# EAGLE design Adafruit 128x64 Mono OLED PCB v2 (EAGLE 6.2)
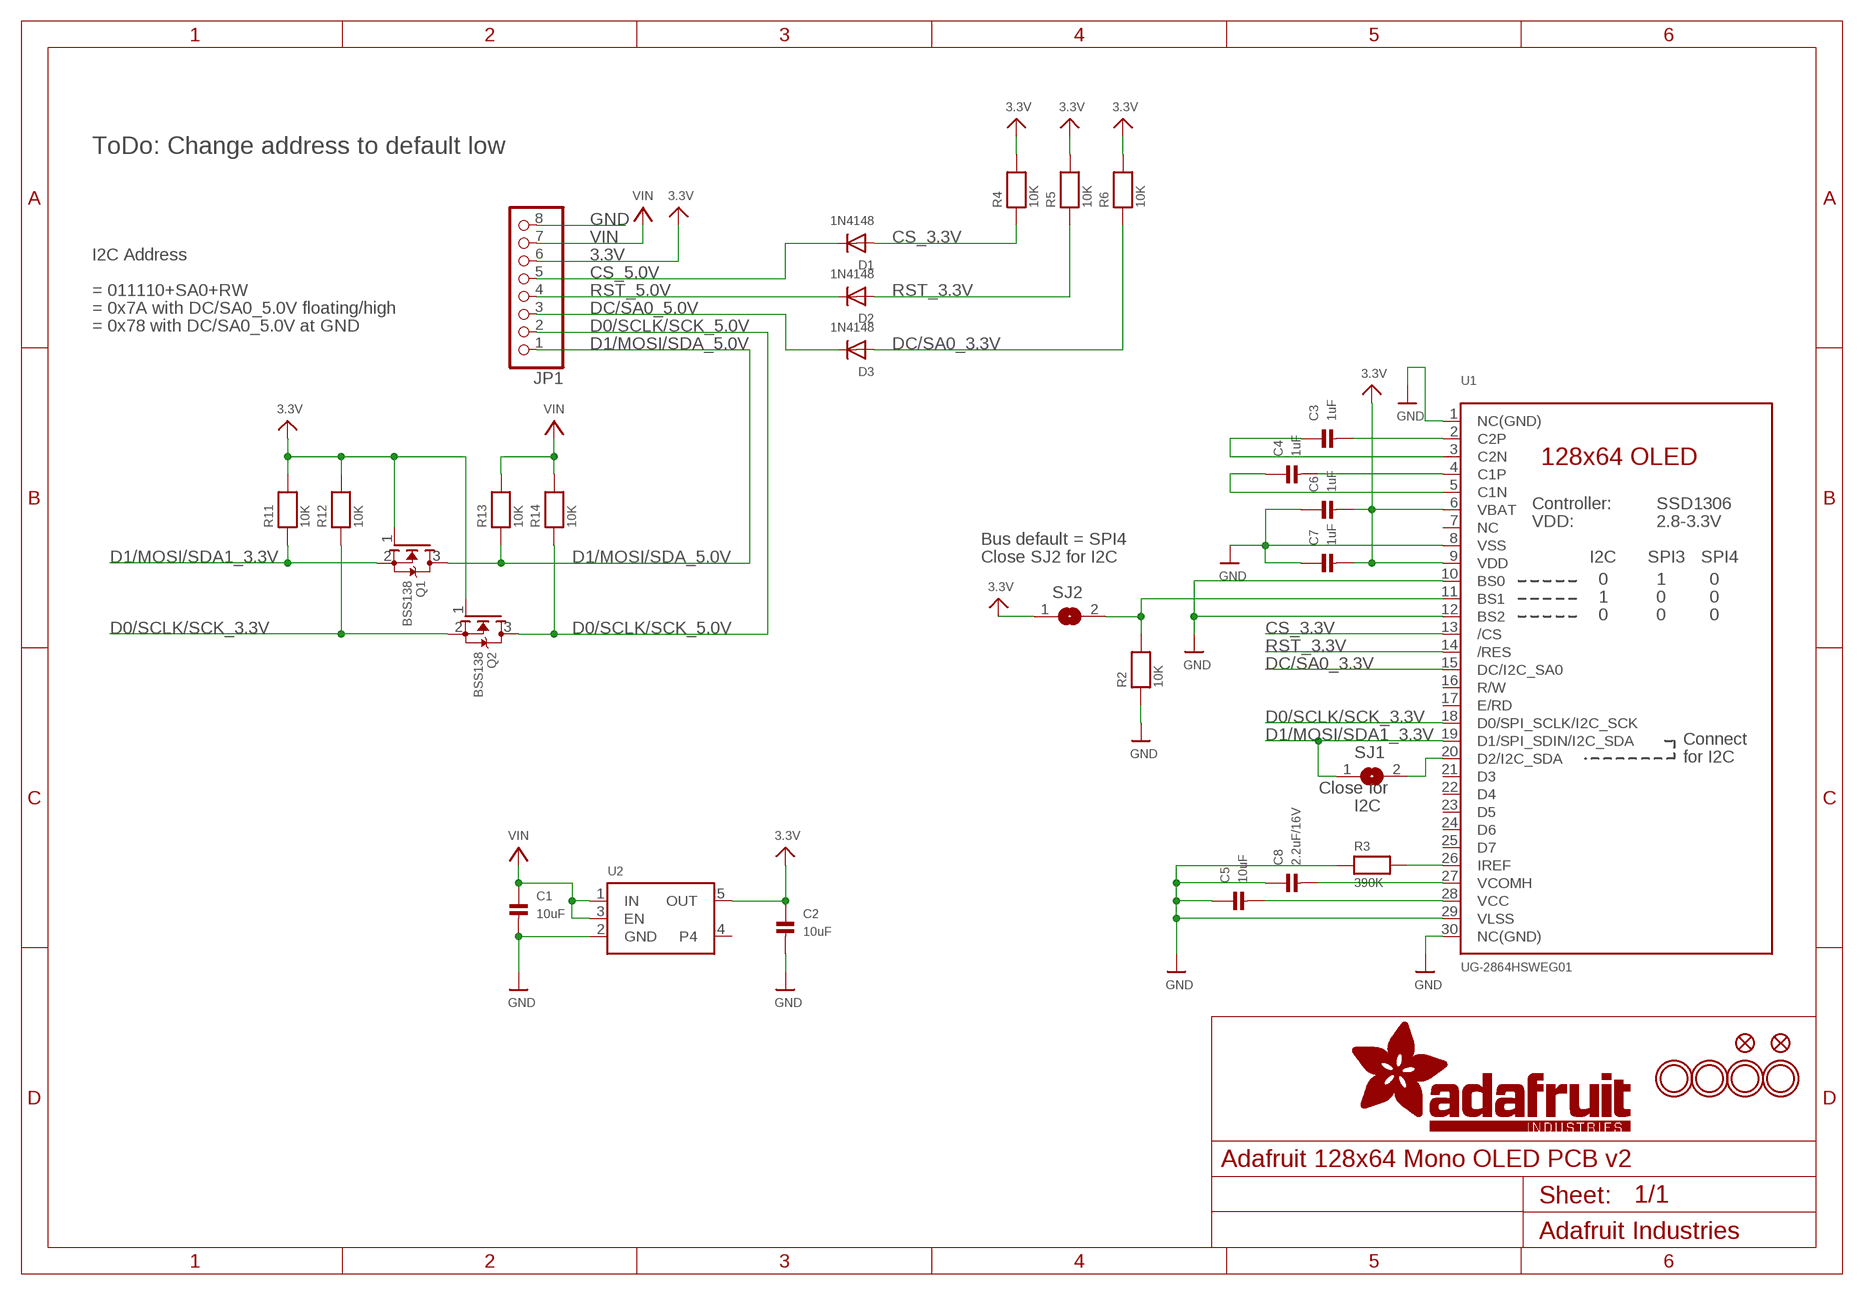
[diagram p0: schematic, sheet 1]

## Parts
C1  10uF  CAP_CERAMIC0805  [0805]
C2  10uF  CAP_CERAMIC0805  [0805]
C3  1uF  CAP_CERAMIC0805  [0805]
C4  1uF  CAP_CERAMIC0805  [0805]
C5  10uF  CAP_CERAMIC0805  [0805]
C6  1uF  CAP_CERAMIC0805  [0805]
C7  1uF  CAP_CERAMIC0805  [0805]
C8  2.2uF/16V  CAP_CERAMIC0805  [0805]
D1  1N4148  DIODESOD-323  [SOD-323]
D2  1N4148  DIODESOD-323  [SOD-323]
D3  1N4148  DIODESOD-323  [SOD-323]
FID1  FIDUCIAL""  [FIDUCIAL_1MM]
FID2  FIDUCIAL""  [FIDUCIAL_1MM]
JP1  HEADER-1X870MIL  [1X08_ROUND_70]
Q1  BSS138  MOSFET-NWIDE  [SOT23-WIDE]
Q2  BSS138  MOSFET-NWIDE  [SOT23-WIDE]
R2  10K  RESISTOR0805  [0805]
R3  390K  RESISTOR0805  [0805]
R4  10K  RESISTOR0805  [0805]
R5  10K  RESISTOR0805  [0805]
R6  10K  RESISTOR0805  [0805]
R11  10K  RESISTOR0805  [0805]
R12  10K  RESISTOR0805  [0805]
R13  10K  RESISTOR0805  [0805]
R14  10K  RESISTOR0805  [0805]
SJ1  SOLDERJUMPERREFLOW_NOPASTE  [SOLDERJUMPER_REFLOW_NOPASTE]
SJ2  SOLDERJUMPERREFLOW_NOPASTE  [SOLDERJUMPER_REFLOW_NOPASTE]
U1  UG-2864HSWEG01  DISP_OLED_UG-2864HSWEG010.96"  [UG-2864HSWEG01_0.96IN_WRAPAROUND]
U2  VREG_SOT23-5  [SOT23-5]
U$23  MOUNTINGHOLE2.5  [MOUNTINGHOLE_2.5_PLATED]
U$24  MOUNTINGHOLE2.5  [MOUNTINGHOLE_2.5_PLATED]
U$25  MOUNTINGHOLE2.5  [MOUNTINGHOLE_2.5_PLATED]
U$26  MOUNTINGHOLE2.5  [MOUNTINGHOLE_2.5_PLATED]

## Nets
3.3V: C2.1 C6.2 C7.2 JP1.6 Q1.1(G) Q2.1(G) R4.2 R5.2 R6.2 R11.2 R12.2 SJ2.1 U1.6(VBAT) U1.9(VDD) U2.5(OUT)
CS_3.3V: D1.A R4.1 U1.13(/CS)
CS_5.0V: D1.C JP1.5
D0/SCLK/SCK_3.3V: Q2.2(S) R12.1 U1.18(D0/SPI_SCLK/I2C_SCK)
D0/SCLK/SCK_5.0V: JP1.2 Q2.3(D) R14.1
D1/MOSI/SDA1_3.3V: Q1.2(S) R11.1 SJ1.1 U1.19(D1/SPI_SDIN/I2C_SDA)
D1/MOSI/SDA_5.0V: JP1.1 Q1.3(D) R13.1
DC/SA0_3.3V: D3.A R6.1 U1.15(DC/I2C_SA0)
DC/SA0_5.0V: D3.C JP1.3
GND: C1.2 C2.2 C5.1 C6.1 C7.1 C8.1 JP1.8 R2.1 R3.1 U1.1(NC(GND)) U1.8(VSS) U1.10(BS0) U1.12(BS2) U1.29(VLSS) U1.30(NC(GND)) U2.2(GND)
N$1: R2.2 SJ2.2 U1.11(BS1)
N$2: SJ1.2 U1.20(D2/I2C_SDA)
N$3: R3.2 U1.26(IREF)
N$4: C3.2 U1.2(C2P)
N$5: C3.1 U1.3(C2N)
N$6: C4.2 U1.4(C1P)
N$7: C4.1 U1.5(C1N)
N$11: C5.2 U1.28(VCC)
N$12: C8.2 U1.27(VCOMH)
RST_3.3V: D2.A R5.1 U1.14(/RES)
RST_5.0V: D2.C JP1.4
VIN: C1.1 JP1.7 R13.2 R14.2 U2.1(IN) U2.3(EN)
Unconnected: U1.7(NC) U1.16(R/W) U1.17(E/RD) U1.21(D3) U1.22(D4) U1.23(D5) U1.24(D6) U1.25(D7) U2.4

## Notes on the sheet
- ToDo: Change address to default low
- I2C Address
- = 011110+SA0+RW
- = 0x7A with DC/SA0_5.0V floating/high
- = 0x78 with DC/SA0_5.0V at GND
- Bus default = SPI4
- Close SJ2 for I2C
- Close for
- I2C

## Library data of the parts
C1-C8 = microbuilder:CAP_CERAMIC: Ceramic Capacitors 0402 - 0402 Surface Mount Capacitors 16pF 50V 5% [Digikey: 445-4899-2-ND] 18pF 50V 5% [Digikey: 490-1281-2-ND] 22pF 50V 5% [Digikey: 490-1283-2-ND] 68pF 50V 5% [Digikey: 490-1289-2-ND] 0.1uF 10V 10% [Digikey: 490-1318-2-ND] 1.0uF 6.3V 10% [Digikey: 490-1320-2-ND] 0603 - 0603 Surface Mount Capacitors 16 pF 50V 5% [Digikey: 445-5051-2-ND] 22 pF 50V [Digikey: PCC220ACVTR-ND] 33 pF 50V 5% [Digikey: 490-1415-1-ND] 56pF 50V 5% [Digikey: 490-1421-1-ND] 220pF 50V 5% [Digikey: 445-1285-1-ND] 680 pF 50V 2200 pF 50V 5% C0G [Digikey: 445-1297-1-ND] 5600 pF 100V 5% X7R [Digikey: 478-3711-1-ND] 0.1 µF 25V 10% [Digikey: PCC2277TR-ND] 0.22 µF 16V 10% X7R [Digikey: 445-1318-1-ND] 1.0 µF 25V 10% [Digikey: 445-5146-2-ND] 0603 - RF Specific 3pF 250V +/-0.1pF RF [Digikey: 712-1347-1-ND] 18 pF 250V 5% [Digikey: 478-3505-1-ND or 712-1322-1-ND] 56 pF 250V 5% C0G RF [Digikey: 490-4867-1-ND] 68 pF 250V RF [Digikey: 490-4868-1-ND] 0805 - 0805 Surface Mount Capacitors 220 pF 250V 2% RF Ceramic Capacitor [Digikey: 712-1398-1-ND] 1000 pF 50V 2% NP0 Ceramic Capacitor [Digikey: 478-3760-1-ND] 0.1 µF 25V 10% Ceramic Capacitor [Digikey: PCC1828TR-ND] 1.0 µF 16V 10% Ceramic Capacitor[Digikey: 490-1691-2-ND] 10.0 µF 10V 10% Ceramic Capacitor[Digikey: 709-1228-1-ND] 10.0 uF 16V 10% Ceramic Capacitor [Digikey: 478-5165-2-ND] 47 uF 6.3V 20% Ceramic Capacitor [Digikey: 587-1779-1-ND or 399-5506-1-ND] 1206 - 1206 Surface Mount Capacitors 47uF 10V 20% Ceramic Capacitor [Digikey: 490-5528-1-ND or 399-5508-1-ND or 445-6010-1-ND] 100uF 6.3V -20%, +80% Y5V Ceramic Capacitor (Digikey: 490-4512-1-ND, Mouser: 81-GRM31CF50J107ZE1L)
D1-D3 = microbuilder:DIODE: Diode SMA Model Volts Amps Type Vf Vr Digikey # Notes SSA34-E3 40V 3A Schottky 480mV @ 3A 200uA @ 40V SSA34-E3/61TGITR-ND CDBA120-G 20V 1A Schottky 500mV @ 1A 500uA @ 20V 641-1014-6-ND REEL MBRA210 10V 2A Schottky 350mV @ 2A 700uA @ 10V MBRA210LT3 SOD-123 Model Volts Amps Type Vf Vr Order # Notes BAT54T1G 30V 200mA Schottky 800mV @ 200mA 2uA @ 25V BAT54T1GOSTR-ND B0530W 30V 500mA Schottky 430mV @ 500mA 130uA @ 30V B0530W-FDICT-ND REEL MBR120 1A 20V Schottky 340mV @ 1A MBR120VLSFT1GOSCT-ND SOD-323 Model Volts Amps Type Vf Vr Order # Notes ZLLS410 10V 570mA Schottky 380mV @ 570mA ZLLS410CT-ND 1N4148WS 75V 150mA Silicon/Simple 1V 1N4148WSFSCT-ND REEL SOD-523 Model Volts Amps Type Vf Vr Order # Notes BAT54XV2 30V 200mA Schottky 0.8V @ 100mA BAT54XV2CT-ND TB751S 30V 30mA Schottky RB751S-40TE61CT-ND SOT23-R/W (R = Solder Paste/Reflow Ovens, W = Hand-Soldering) Model Volts Amps Type Vf Vr Order # Notes BAT54FILM 40V 300mA Schottky 497-7162-1-ND
FID1 FID2 = microbuilder:FIDUCIAL: Fiducial Alignment Points Various fiducial points for machine vision alignment.
JP1 = microbuilder:HEADER-1X8: PIN HEADER
Q1 Q2 = microbuilder:MOSFET-N: N-Channel Mosfet LEGEND VDS: Voltage Drain-Source ID: Drain Current RDS(ON): Drain-Source On-State Resistance VGS(TH): Gate-Source Threshold Voltage CISS: Drain-Source Input Capacitance SOT-23 Name VDS ID RDS(ON) VGS(TH) CISS Order Number 2N7002E 60V 260mA 2.5 Ohm 2.5V @ 250uA 26.7pF @ 25V 2N7002ET1GOSTR-ND BSH103 30V 850mA 400 mOhm 400mV @ 1mA 83pF @ 24V BSH103,235-ND BSS138 60V 320mA 1.6 Ohm 1.5V @ 250uA 50pF @ 10V Mouser: 771-BSS138PW115 * BSS138 good choice for I2C level-shifting
R2-R6 R11-R14 = microbuilder:RESISTOR: Resistors 0402 - 0402 Surface Mount Package 22 Ohm 1% 1/16W [Digikey: 311-22.0LRTR-ND] 33 Ohm 5% 1/16W 1.0K 5% 1/16W 1.5K 5% 1/16W 2.0K 1% 1/16W 10.0K 1% 1/16W [Digikey: 311-10.0KLRTR-ND] 10.0K 5% 1/16W [Digikey: RMCF0402JT10K0TR-ND] 12.1K 1% 1/16W [Digikey: 311-22.0LRTR-ND] 100.0K 5% 1/16W 0603 - 0603 Surface Mount Package 0 Ohm 1/10 Watt 1% Resistor 15 Ohm 1/10 Watt 1% Resistor 33 Ohm 1/10 Watt 1% Resistor 49.9 Ohm 1/10 Watt 1% Resistor 100 Ohm 1/10 Watt 1% Resistor 150 Ohm 1/10 Watt 1% Resistor 240 Ohm 1/10 Watt 1% Resistor 390 Ohm 1/10 Watt 1% Resistor 560 Ohm 1/10 Watt 1% Resistor 680 Ohm 1/10 Watt 1% Resistor 750 Ohm 1/10 Watt 1% Resistor 1.0K Ohm 1/10 Watt 1% Resistor 1.5K Ohm 1/10 Watt 1% Resistor 2.0K Ohm 1/10 Watt 1% Resistor 2.2K Ohm 1/10 Watt 1% Resistor 3.3K Ohm 1/10 Watt 1% Resistor 4.7K Ohm 1/10 Watt 1% Resistor 10.0K Ohm 1/10 Watt 1% Resistor 12.0K Ohm 1/10 Watt 1% Resistor 12.1K Ohm 1/10 Watt 1% Resistor 20.0K Ohm 1/10 Watt 1% Resistor 33.0K Ohm 1/10 Watt 1% Resistor 100.0K Ohm 1/10 Watt 1% Resistor 0805 - 0805 Surface Mount Package 0 Ohm 1/8 Watt 1% Resistor 33 Ohm 1/8 Watt 1% Resistor 100 Ohm 1/8 Watt 1% Resistor 150 Ohm 1/8 Watt 1% Resistor 200 Ohm 1/8 Watt 1% Resistor 240 Ohm 1/8 Watt 1% Resistor 330 Ohm 1/8 Watt 1% Resistor 390 Ohm 1/8 Watt 1% Resistor 470 Ohm 1/8 Watt 1% Resistor 1.0K Ohm 1/8 Watt 1% Resistor 1.5K Ohm 1/8 Watt 1% Resistor 2.0K Ohm 1/8 Watt 1% Resistor 4.7K Ohm 1/8 Watt 1% Resistor 5.1K Ohm 1/8 Watt 1% Resistor 5.6K Ohm 1/8 Watt 1% Resistor 10.0K Ohm 1/8 Watt 1% Resistor 22.0K Ohm 1/8 Watt 1% Resistor 33.0K Ohm 1/8 Watt 1% Resistor 100K Ohm 1/8 Watt 1% Resistor 1206 - 1206 Surface Mount Package 2012 - 2010 Surface Mount Package 0.11 Ohm 1/2 Watt 1% Resistor - Digikey: RHM.11UCT-ND
SJ1 SJ2 = microbuilder:SOLDERJUMPER: SMD Solder JUMPER Solder the two pads together to create a connection, or remove the solder to break it. REFLOW - Use this footprint for solder paste and reflow ovens. WAVE - Use this footprint for hand-soldering (larger pads). CLOSED - Has a trace between the two pads to ensure it is closed by default. The trace needs to be cut to disable the jumper, and can be closed again by creating a solder bridge between the two pads.
U1 = microbuilder:DISP_OLED_UG-2864HSWEG01: UG-2864HSWEG01 OLED display Both 1.3" and 0.96" models share the same FPC tab footprint, only the screen dimensions vary.
U2 = microbuilder:VREG_SOT23-5: SOT23-5 Fixed Voltage Regulators To better organise some of the SOT23-5 fixed voltage regulators in this library, this new part was created. Part Current Out V Out V In V Dropout Digikey Part No. ADP121 150mA 3.3V 3.4-5.5V 0.09V @ 150mA ADP121-AUJZ33R7CT-ND ADP121 150mA 3.0V 3.1-5.5V 0.09V @ 150mA ADP121-AUJZ30R7CT-ND ADP122 300mA 3.3V 3.4-5.5V 0.085V @ 300mA ADP122AUJZ-3.3-R7CT-ND ADP1712 300mA 3.3V 3.5-5.5V 0.17V @ 300mA ADP1712AUJZ-3.3-R7TR-ND AP7311 (Low Cost) 150mA 3.3V 3.5-6V 0.15V @ 150mA AP7311-33WG-7DICT-ND LD39015M18R 150mA 1.8V 1.9V-5.5V 0.08V @ 100mA 497-6977-1-ND MCP1824T-3302E/OT 300mA 3.3V 3.5V-6V 0.2V @ 300mA MCP1824T-3302E/OTCT-ND MIC5205-2.5YM5 TR 150mA 2.5V 2.7-16V 0.165V @ 150mA 576-1257-2-ND MIC5205-3.0YM5 TR 150mA 3.0V 3.2V-16V 0.165V @ 150mA 576-1258-2-ND MIC5205-3.3YM5 TR 150mA 3.3V 3.5V-16V 0.165V @ 150mA 576-1259-2-ND TPS780330220 150mA 3.3V+2.2V 3.6-5.5V 250mV Max 296-23332-1-ND TDA3663/N1,135 100mA 3.3V 3.5-45V 0.18V @ 50mA 568-5343-1-ND
U$23-U$26 = microbuilder:MOUNTINGHOLE: Mounting Hole For #2 screws (0.086"/2.18mm width, 0.094"/2.4mm hole) use 2.5mm

## Board
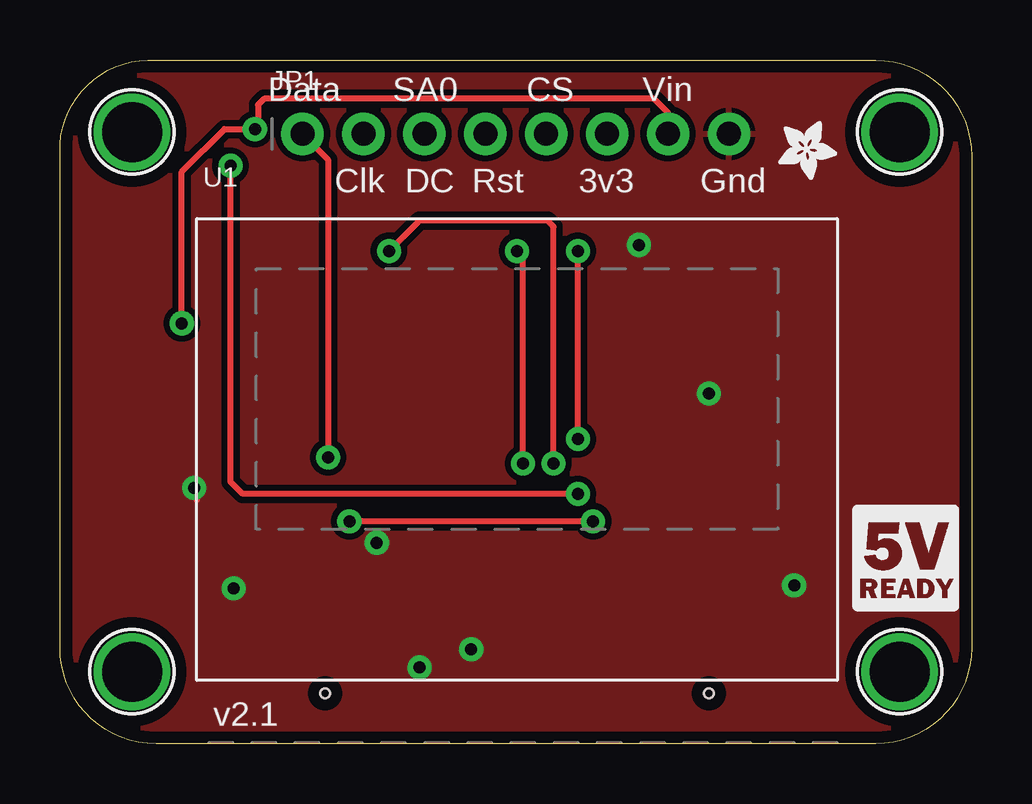
[diagram p1: board, top side]
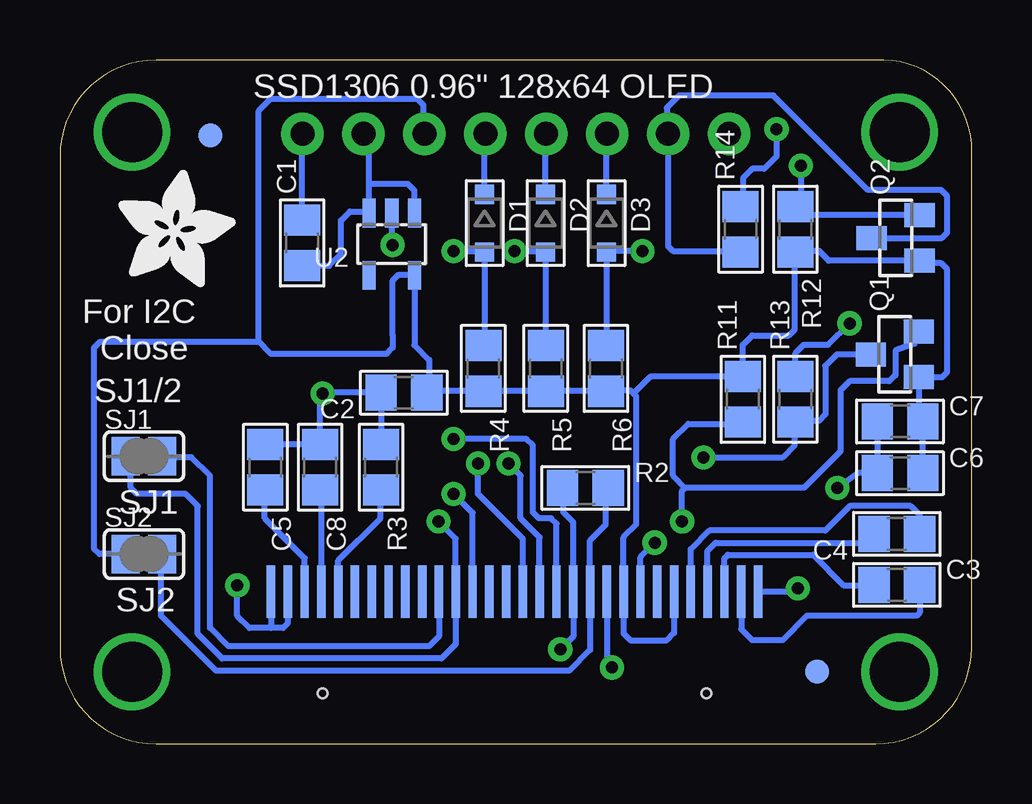
[diagram p2: board, bottom side, seen from below]

Size 38 x 28.51 mm. Coordinates in mm from the lower left corner, seen from the top.
Outline: 0,4 0,25 arc-90 4,28.5 34,28.5 arc-90 38,24.5 38,4 arc-90 34,0 4,0 arc-90 0,4
Copper layers (1*16): Top 0.035mm / dielectric 1.5mm / Bottom 0.035mm
Design rules: minimum track width 8mil, minimum drill 0.4mm, track to track 8mil, track to pad 8mil, pad to pad 8mil, via to via 8mil, smd to smd 8mil, copper to edge 20mil, drill to drill 8mil, minimum pad ring 8mil, minimum via ring 10mil, stop-mask expansion 3mil, vias tented up to drill 20mil, thermal gap 8mil

### Footprints (pad centres in the part's own frame; a part is rotated, then mirrored left to right if it is on the bottom)
0805 = smd 1.3 x 1.5: 1 -0.95,0; 2 0.95,0
SOD-323 = smd 0.8 x 0.8: A 1.2,0; C -1.2,0
FIDUCIAL_1MM = smd 1 x 1: 1 0,0
1X08_ROUND_70 = drill 1 pad 1.778: 1 -8.89,0; 2 -6.35,0; 3 -3.81,0; 4 -1.27,0; 5 1.27,0; 6 3.81,0; 7 6.35,0; 8 8.89,0
SOT23-WIDE = smd 1 x 1.27: 1 -0.95,-1; 2 0.95,-1; 3 0,1
SOLDERJUMPER_REFLOW_NOPASTE = smd 1.168 x 1.6: 1 -0.762,0; 2 0.762,0
UG-2864HSWEG01_0.96IN_WRAPAROUND = smd 0.35 x 2.2 bottom: 1 -10.15,-1.2; 2 -9.45,-1.2; 3 -8.75,-1.2; 4 -8.05,-1.2; 5 -7.35,-1.2; 6 -6.65,-1.2; 7 -5.95,-1.2; 8 -5.25,-1.2; 9 -4.55,-1.2; 10 -3.85,-1.2; 11 -3.15,-1.2; 12 -2.45,-1.2; 13 -1.75,-1.2; 14 -1.05,-1.2; 15 -0.35,-1.2; 16 0.35,-1.2; 17 1.05,-1.2; 18 1.75,-1.2; 19 2.45,-1.2; 20 3.15,-1.2; 21 3.85,-1.2; 22 4.55,-1.2; 23 5.25,-1.2; 24 5.95,-1.2; 25 6.65,-1.2; 26 7.35,-1.2; 27 8.05,-1.2; 28 8.75,-1.2; 29 9.45,-1.2; 30 10.15,-1.2 | hole 0.4: -8,-5.45; 8,-5.45
SOT23-5 = smd 0.55 x 1.2: 1 -0.95,-1.3; 2 0,-1.3; 3 0.95,-1.3; 4 0.95,1.3; 5 -0.95,1.3
MOUNTINGHOLE_2.5_PLATED = drill 2.5 pad 3.2: P$1 0,0

### Placement (x,y rotation side)
C1  27.91,20.88 90 bottom
C2  23.66,14.64 180 bottom
C3  3.11,6.62 0 bottom
C4  3.11,8.75 180 bottom
C5  29.44,11.53 270 bottom
C6  2.98,11.28 0 bottom
C7  2.98,13.44 0 bottom
C8  27.15,11.53 270 bottom
D1  20.3,21.7 270 bottom
D2  17.76,21.7 270 bottom
D3  15.22,21.7 270 bottom
FID1  31.73,25.36 0 bottom
FID2  6.43,3.02 0 bottom
JP1  19,25.43 0 top
Q1  3.2,16.23 90 bottom
Q2  3.16,21.09 90 bottom
R2  16.1,10.66 0 bottom
R3  24.61,11.53 270 bottom
R4  20.35,15.64 270 bottom
R5  17.75,15.64 270 bottom
R6  15.24,15.64 270 bottom
R11  9.53,14.36 90 bottom
R12  7.34,21.45 270 bottom
R13  7.34,14.36 90 bottom
R14  9.63,21.45 90 bottom
SJ1  34.5,11.99 0 bottom
SJ2  34.5,7.91 0 bottom
U1  19.05,7.54 0 top
U2  24.17,20.83 180 bottom
U$3  [ADAFRUIT_5MM]  35.56,19.05 0 bottom
U$23  35,25.5 0 top
U$24  3,3 0 top
U$25  35,3 0 top
U$26  3,25.5 0 top
U$27  [ADAFRUIT_2.5MM]  29.96,25.95 270 top
U$28  [LOGIC_5VREADY_5MM]  32.75,5.25 0 top

### Tracks (layer width: path | path; a pad name or v marks a point on that pad's centre or on a via)
3.3V
  Bottom 0.254: U1.6 12.4,4.62 12.7,4.32 14.22,4.32 14.5,4.6 U1.9 14.5,8.61 13.97,9.14 13.97,14.48 14.1,14.61 | 14.1,14.61 14.22,14.73 15.2,14.73 R6.2 R5.2 R4.2 22.65,14.7 C2.1 22.61,14.74 22.61,16 23.22,16.62 U2.5 23.25,19.56 23.88,19.56 24.13,19.3 24.13,17.02 24.13,16.51 24.38,16.26 29.21,16.26 29.72,16.76 | 29.72,16.76 29.72,26.38 29.21,26.89 23.11,26.89 22.86,26.64 22.86,25.48 JP1.6 | C6.2 C7.2 2.2,13.1 Q1.1 1.23,15.28 1.02,15.49 1.02,19.78 1.27,20.03 2.05,20.03 Q2.1 5.95,20.14 6.35,20.54 7.3,20.54 R12.2 7.37,20.47 7.37,17.27 7.62,17.02 9.14,17.02 9.53,16.63 R11.2 13.39,15.31 14.1,14.61 | SJ2.1 36.35,7.91 36.58,8.13 36.58,16.51 36.32,16.76 29.72,16.76
CS_3.3V  (via drill 0.5)
  Top 0.254: v21.59,12.7 v21.59,20.54
  Bottom 0.254: R4.1 20.3,16.65 D1.A 20.34,20.54 v21.59,20.54 | U1.13 17.3,9.17 17.53,9.4 18.03,9.4 18.29,9.65 18.29,12.45 18.54,12.7 v21.59,12.7
CS_5.0V
  Bottom 0.254: D1.C 20.3,25.4 JP1.5
D0/SCLK/SCK_3.3V  (via drill 0.5)
  Top 0.254: v21.59,10.41 7.62,10.41 7.11,10.92 v7.11,24.1
  Bottom 0.254: 7.29,22.45 R12.1 | U1.18 20.8,9.63 v21.59,10.41 | v7.11,24.1 7.11,22.63 R12.1 | Q2.2 6.98,22.04 R12.1
D0/SCLK/SCK_5.0V
  Bottom 0.254: R14.1 9.67,20.54 12.45,20.54 12.65,20.75 JP1.2 12.7,25.48 12.7,26.51 12.19,27.02 8.26,27.02 4.32,23.08 1.27,23.08 1.02,22.83 1.02,21.3 1.23,21.09 Q2.3
D1/MOSI/SDA1_3.3V  (via drill 0.5)
  Top 0.254: v22.23,9.27 v12.06,9.27
  Bottom 0.254: SJ1.1 35.05,11.78 35.05,10.67 34.8,10.41 32.77,10.41 32.26,9.91 32.26,4.57 31.24,3.56 22.1,3.56 21.5,4.15 U1.19 21.5,8.55 v22.23,9.27 | Q1.2 2.38,16.67 3.17,16.38 3.17,15.37 3.43,15.11 5.08,15.11 5.46,14.73 5.46,12.19 6.99,10.67 11.94,10.67 | R11.1 9.61,13.34 11.81,13.34 12.45,12.7 12.45,11.18 11.94,10.67 | v12.06,9.27 12.06,10.54 11.94,10.67
D1/MOSI/SDA_5.0V  (via drill 0.5)
  Top 0.254: JP1.1 10.11,25.42 11.18,24.35 v11.18,11.94
  Bottom 0.254: v11.18,11.94 7.87,11.94 7.37,12.45 7.37,13.39 R13.1 7.29,13.46 6.35,13.46 6.1,13.72 6.1,15.75 5.61,16.23 Q1.3
DC/SA0_3.3V  (via drill 0.5)
  Top 0.254: v20.57,11.68 20.57,21.56 20.32,21.81 14.99,21.81 v13.72,20.54
  Bottom 0.254: R6.1 15.22,16.62 D3.A 15.18,20.54 v13.72,20.54 | U1.15 18.7,8.54 20.57,10.41 v20.57,11.68
DC/SA0_5.0V
  Bottom 0.254: D3.C 15.22,25.4 JP1.3
GND  (via drill 0.5)
  Top 0.254: v5.59,10.67 5.59,10.29 5.71,10.16 | v7.24,6.48 6.86,6.48 | v14.99,3.17 14.99,2.92 | v17.14,3.94 17.27,3.94 | v13.21,8.38 13.21,8.51 | v30.61,6.6 30.61,6.86 | v27.05,14.61 27.3,14.61 | v24.13,20.8 24.26,20.8 24.38,20.92
  Bottom 0.254: C7.1 C6.1 4.72,11.28 v5.59,10.67 | U1.1 7.37,6.34 v7.24,6.48 | R2.1 17.02,10.63 17.02,9.65 16.6,9.24 U1.12 16.6,4.48 v17.14,3.94 | U1.10 15.2,3.39 v14.99,3.17 | U1.8 13.8,7.79 v13.21,8.38 | U1.29 28.5,5.03 28.7,4.83 29.21,4.83 | 29.21,4.83 30.1,4.83 30.61,5.33 v30.61,6.6 | U1.30 29.2,4.83 29.21,4.83 | C5.1 C8.1 27.15,14.5 v27.05,14.61 27.02,14.64 C2.2 R3.1 | C1.2 27.91,25.41 JP1.8 | U2.2 24.17,20.84 v24.13,20.8
  pour Top (isolate 0.254): 0,0 0,28.42 37.72,28.42 37.72,0
N$1
  Bottom 0.254: R2.2 15.24,10.57 15.24,9.14 15.9,8.48 U1.11 15.9,3.91 16.76,3.05 31.5,3.05 33.78,5.33 33.78,7.86 SJ2.2
N$2
  Bottom 0.254: U1.20 22.2,4.47 22.61,4.06 30.99,4.06 31.75,4.83 31.75,11.18 32.51,11.94 33.69,11.94 SJ1.2
N$3
  Bottom 0.254: U1.26 26.4,7.63 24.64,9.4 24.64,10.55 R3.2
N$4
  Bottom 0.254: C3.2 2.16,5.46 2.29,5.33 6.86,5.33 7.87,4.32 9.14,4.32 9.6,4.78 U1.2
N$5
  Bottom 0.254: U1.3 10.3,7.73 10.16,7.87 6.6,7.87 5.33,6.6 4.08,6.6 C3.1
N$6
  Bottom 0.254: U1.4 11,8.05 10.67,8.38 4.17,8.38 C4.2
N$7
  Bottom 0.254: C4.1 2.16,9.53 2.54,9.91 5.08,9.91 6.1,8.89 10.92,8.89 11.7,8.11 U1.5
N$11
  Bottom 0.254: U1.28 27.8,7.74 29.46,9.4 29.46,10.55 C5.2
N$12
  Bottom 0.254: U1.27 27.1,10.52 C8.2
RST_3.3V  (via drill 0.5)
  Top 0.254: v19.3,11.68 19.3,20.29 v19.05,20.54
  Bottom 0.254: R5.1 17.76,16.6 D2.A 17.8,20.54 v19.05,20.54 | U1.14 18,8.6 18.8,9.4 18.8,11.18 v19.3,11.68
RST_5.0V
  Bottom 0.254: D2.C 17.76,25.4 JP1.4
VIN  (via drill 0.5)
  Top 0.254: v5.08,17.53 5.08,23.84 6.86,25.62 v8.13,25.62 8.26,25.75 8.26,26.64 8.51,26.89 24.77,26.89 25.35,26.31 JP1.7
  Bottom 0.254: 25.12,23.34 U2.3 25.19,22.19 25.91,22.19 26.29,21.81 26.29,20.41 26.78,19.93 C1.1 | 25.12,23.34 25.12,25.2 JP1.7 | R13.2 7.34,16.28 6.99,16.64 5.97,16.64 v5.08,17.53 | v8.13,25.62 8.13,24.48 8.64,23.97 9.14,23.97 9.53,23.59 9.53,22.5 R14.2 | U2.1 23.22,23.06 23.5,23.34 25.12,23.34

### Text on the board
tPlace: Data | SA0 | CS | Vin | Clk | DC | Rst | 3v3 | Gnd | v2.1
bPlace: SSD1306 0.96" 128x64 OLED | For I2C | Close | SJ1/2 | SJ1 | SJ2